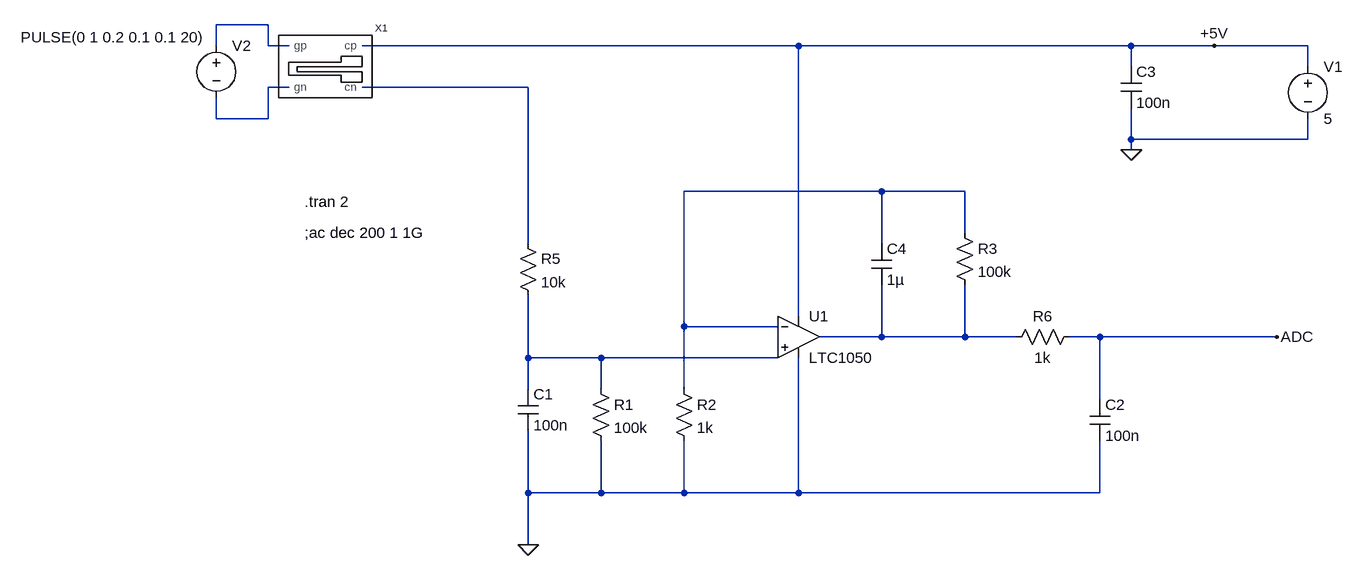
[diagram p0: schematic Schéma_solution_Ampli_Transimpédance.asc]
Schéma_solution_Ampli_Transimpédance.asc, the LTspice schematic file:
Version 4
SHEET 1 880 680
WIRE -1568 -496 -1648 -496
WIRE -1648 -464 -1648 -496
WIRE -1568 -464 -1568 -496
WIRE -1536 -464 -1568 -464
WIRE -752 -464 -1424 -464
WIRE -240 -464 -752 -464
WIRE -112 -464 -240 -464
WIRE 32 -464 -112 -464
WIRE -240 -432 -240 -464
WIRE 32 -432 32 -464
WIRE -1536 -400 -1568 -400
WIRE -1168 -400 -1424 -400
WIRE -1648 -352 -1648 -384
WIRE -1568 -352 -1568 -400
WIRE -1568 -352 -1648 -352
WIRE -240 -320 -240 -368
WIRE 32 -320 32 -352
WIRE 32 -320 -240 -320
WIRE -240 -304 -240 -320
WIRE -624 -240 -928 -240
WIRE -496 -240 -624 -240
WIRE -496 -176 -496 -240
WIRE -1168 -160 -1168 -400
WIRE -624 -160 -624 -240
WIRE -752 -48 -752 -464
WIRE -928 -32 -928 -240
WIRE -784 -32 -928 -32
WIRE -624 -16 -624 -96
WIRE -624 -16 -720 -16
WIRE -496 -16 -496 -96
WIRE -496 -16 -624 -16
WIRE -416 -16 -496 -16
WIRE -288 -16 -336 -16
WIRE -16 -16 -288 -16
WIRE -1168 16 -1168 -80
WIRE -1056 16 -1168 16
WIRE -784 16 -784 0
WIRE -784 16 -1056 16
WIRE -1168 64 -1168 16
WIRE -1056 64 -1056 16
WIRE -928 64 -928 -32
WIRE -288 80 -288 -16
WIRE -1168 224 -1168 128
WIRE -1056 224 -1056 144
WIRE -1056 224 -1168 224
WIRE -928 224 -928 144
WIRE -928 224 -1056 224
WIRE -752 224 -752 16
WIRE -752 224 -928 224
WIRE -288 224 -288 144
WIRE -288 224 -752 224
WIRE -1168 304 -1168 224
FLAG -1168 304 0
FLAG -240 -304 0
FLAG -112 -464 +5V
FLAG -16 -16 ADC
SYMBOL cap -1184 64 R0
SYMATTR InstName C1
SYMATTR Value 100n
SYMBOL res -1072 48 R0
SYMATTR InstName R1
SYMATTR Value 100k
SYMBOL res -944 48 R0
SYMATTR InstName R2
SYMATTR Value 1k
SYMBOL OpAmps\\LTC1050 -752 -80 R0
SYMATTR InstName U1
SYMBOL res -320 -32 R90
WINDOW 0 0 56 VBottom 2
WINDOW 3 32 56 VTop 2
SYMATTR InstName R6
SYMATTR Value 1k
SYMBOL cap -304 80 R0
SYMATTR InstName C2
SYMATTR Value 100n
SYMBOL cap -640 -160 R0
SYMATTR InstName C4
SYMATTR Value 1µ
SYMBOL res -512 -192 R0
SYMATTR InstName R3
SYMATTR Value 100k
SYMBOL cap -256 -432 R0
SYMATTR InstName C3
SYMATTR Value 100n
SYMBOL voltage 32 -448 R0
WINDOW 123 0 0 Left 0
WINDOW 39 0 0 Left 0
SYMATTR InstName V1
SYMATTR Value 5
SYMBOL Schéma_simulation_capteur -1488 -416 R0
SYMATTR InstName X1
SYMBOL voltage -1648 -480 R0
WINDOW 3 -301 3 Left 2
WINDOW 123 0 0 Left 0
WINDOW 39 0 0 Left 0
SYMATTR InstName V2
SYMATTR Value PULSE(0 1 0.2 0.1 0.1 20)
SYMBOL res -1184 -176 R0
SYMATTR InstName R5
SYMATTR Value 10k
TEXT -1512 -224 Left 2 !.tran 2
TEXT -1512 -176 Left 2 !;ac dec 200 1 1G

The netlist it stands for:
* Schéma_solution_Ampli_Transimpédance.asc
C1 N006 0 100n
R1 N006 0 100k
R2 N004 0 1k
XU1 N006 N004 +5V 0 N005 LTC1050  ; pins In+ In- V+ V- OUT
R6 ADC N005 1k
C2 ADC 0 100n
C4 N004 N005 1µ
R3 N004 N005 100k
C3 +5V 0 100n
V1 +5V 0 5
XX1 +5V N003 N002 N001 Schéma_simulation_capteur  ; pins cp cn gn gp
V2 N001 N002 PULSE(0 1 0.2 0.1 0.1 20)
R5 N003 N006 10k
.tran 2
;ac dec 200 1 1G
.lib LTC.lib
.backanno
.end